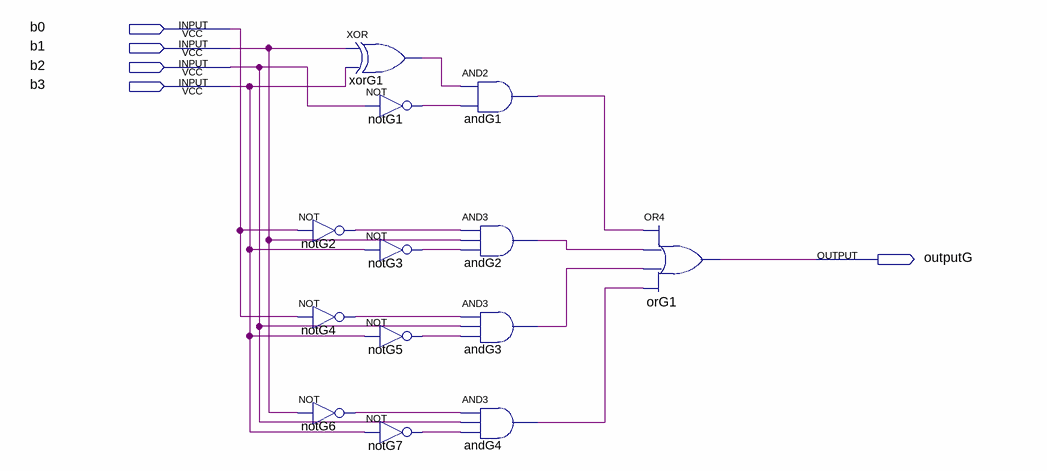
[diagram p0: schematic sheet]
// Quartus schematic g.bdf as structural Verilog: 13 symbols, 5 pins
module g (
  input  b0,
  input  b1,
  input  b2,
  input  b3,
  output outputG
);

  wire andG1_out, andG2_out, andG3_out, andG4_out, notG1_out, notG2_out, notG3_out, notG4_out, notG5_out,
       notG6_out, notG7_out, xorG1_out;

  xor xorG1 (xorG1_out, b1, b3);
  not notG1 (notG1_out, b2);
  not notG2 (notG2_out, b0);
  not notG3 (notG3_out, b3);
  not notG4 (notG4_out, b0);
  not notG5 (notG5_out, b3);
  not notG6 (notG6_out, b1);
  not notG7 (notG7_out, b3);
  and andG1 (andG1_out, xorG1_out, notG1_out);
  and andG2 (andG2_out, notG2_out, b1, notG3_out);
  and andG3 (andG3_out, notG4_out, b2, notG5_out);
  and andG4 (andG4_out, notG6_out, b2, notG7_out);
  or orG1 (outputG, andG1_out, andG2_out, andG3_out, andG4_out);
endmodule
